# Altium project PVP.PrjPcb
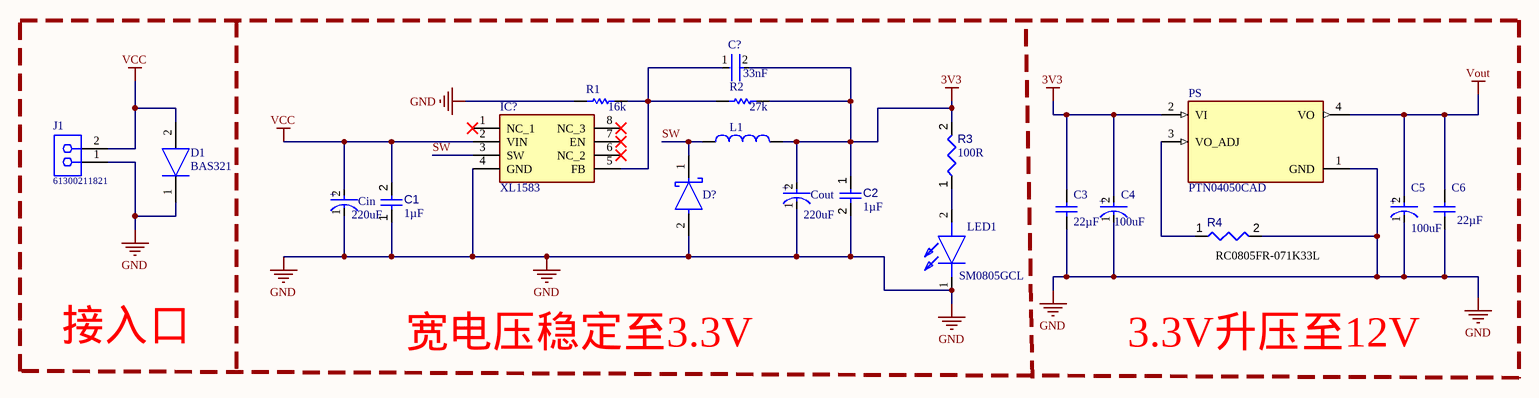
[diagram p0: PVP.SchDoc]
1 sheet, 20 parts. Net scope: global (net labels, ports and power ports of the same name join across sheets).
Board file: PVP.PcbDoc

## Sheet PVP.SchDoc
size A4; SheetNumber: 1; SheetTotal: 1

### Parts
C1  value 1µF  [CAPC2013X135X45NL10T25]  (hidden comment: Capacitor 1 uF +/- 10% 50 V 0805)
C2  value 1µF  [CAPC2013X135X45NL10T25]  (hidden comment: Capacitor 1 uF +/- 10% 50 V 0805)
C3  Capacitance: 22µF  [MURA-1210_H_2.7_L]  (hidden comment: GRM32ER61C226KE20L)
C4  Capacitance: 100uF  [FP-UWX1E101MCL1GB-MFG]  (hidden comment: UWX1E101MCL1GB)
C5  Capacitance: 100uF  [FP-UWX1E101MCL1GB-MFG]  (hidden comment: UWX1E101MCL1GB)
C6  Capacitance: 22µF  [MURA-1210_H_2.7_L]  (hidden comment: GRM32ER61C226KE20L)
C?  Capacitance: 33nF  [FP-C1608-080-0_1-IPC_A]  (hidden comment: C1608X7R1H333K080AA)
Cin  value 220uF  [FP-ESTG4-MFG]  (hidden comment: EST227M035AG4AA)
Cout  value 220uF  [FP-ESTG4-MFG]  (hidden comment: EST227M035AG4AA)
D1  BAS321  [SOD2512X110N]
D?  SS34  [FP-95402-MFG]  (value not drawn)
IC?  XL1583  [SOIC127P600X175-8N]
J1  61300211821  [61300211821]
L1  744212470  [WE-SL1]  (value not drawn)
LED1  SM0805GCL  [LEDC2012X80N]
PS  PTN04050CAD  [CONV_PTN04050CAD]
R1  value 16k  [RESC2013X60X35NL10T20]  (hidden comment: RT0805BRD073KL)
R2  value 27k  [RESC2013X60X35NL10T20]  (hidden comment: RT0805BRD073KL)
R3  value 100R  [RESC2013X60X35ML10T20]  (hidden comment: RC0805FR-07100RL)
R4  1KR5J  [RESC0805(2012)_L]  (value not drawn)

### Nets
3V3: C2.1 C3.2 C4.2(A) C?.2 Cout.2(A) L1.2 PS.2(VI) R2.2 R3.2
GND: C1.1 C2.2 C3.1 C4.1(C) C5.1(C) C6.1 Cin.1(C) Cout.1(C) D1.1(K) D?.2(A) IC?.4(GND) J1.1 LED1.1(K) PS.1(GND) R1.1 R4.2
VCC: C1.2 Cin.2(A) D1.2(A) IC?.2(VIN) J1.2
Vout: C5.2(A) C6.2 PS.4(VO)
SW: D?.1(C) IC?.3(SW) L1.1
NetC?_1: C?.1 IC?.5(FB) R1.2 R2.1
NetLED1_2: LED1.2(A) R3.1
NetPS_3: PS.3(VO_ADJ) R4.1

Not connected (* = marked no-connect by the designer): IC? 1(NC_1)* 6(NC_2)* 7(EN)* 8(NC_3)*

### Notes on the sheet
- (near J1) 外接四块电池板  9V  2W，两块并联，两块串联
- (near D1) 在正常供电的时候二极管反偏;只有当电源反接的时候，二极管正偏导通，此时二极管将后级电路短路。2为正极，1为负极。IFRM=625mA；VRRM=250V；VR=200V。
- 最高12W，最大输出电流3A，输入电压范围为3.6到23V
- (near R4) RC0805FR-071K33L
- 接入口
- 宽电压稳定至3.3V
- (near LED1) 取正向电压2.2V时，对应电流18mA，光强100%左右，则电阻电压为1.1V，1.1v/18ma=61ohm，取100ohm
- 3.3V升压至12V
- 当输出为12V时，电阻要求1.33k，tolerance 1%，100 ppm/°C，以提高精度
- (in symbol CMP-03015-000001-1) +
- (in symbol CMP-12462-000012-1) +

### Library data of the parts
C1 C2 = CMP-001-00007-5: Chip Capacitor, 1 uF, +/- 10%, 50 V, 0805 (2012 Metric); Voltage Rating: 50V; Capacitor Type: Ceramic; Tolerance: 10%; Max Operating Temperature: 125°C; Case/Package: 0805; RoHS Compliant: True; Pins: 2; Mounting Technology: SM; Min Operating Temperature: -55°C
C3 C6 = CMP-2000-06361-1: Chip Monolithic Ceramic Capacitor, 22 uF, +/- 10%, -55 to 85 degC, 2-Pin SMD (1210), RoHS, Tape and Reel; Manufacturer: Murata; Product Training Modules: High-CapMultilayerCeramicCapacitors; Other Names: 490-1882-2; Online Catalog: GRMSeries; Voltage Rating DC: 16V; Temperature Coefficient: X5R; Catalog Drawings: GRMSeries_1210_2.5; Featured Product: GA3SafetyRecognizedCapsandHi-CapMLCC; Applications: GeneralPurpose; Lead Spacing: -; Ratings: -; Standard Package: 1,000; Lead Style: -; Size / Dimension: 0.126"Lx0.098"W(3.20mmx2.50mm); Features: -; Thickness (Max): 0.106"(2.70mm); Package Description: 2-Pin Surface Mount Device, Body 3.2 x 2.5 mm; Series: GRM; Mounting Type: SurfaceMount,MLCC; Category: Capacitors; Package / Case: 1210(3225Metric); Datasheet Version: 05/2014; Datasheet URL: https://datasheet.ciiva.com/26915/getdatasheetpartid-88858-26915376.pdf; Mounting Technology: SurfaceMount; Package Reference: 1210; Tolerance: ±10%; Packaging: Tape&Reel(TR); Operating Temperature: -55°C~85°C; Voltage - Rated: 16V; Height - Seated (Max): -; Family: CeramicCapacitors; Manufacturer URL: http://www.murata.com/
C4 C5 = CMP-12462-000012-1: CAP ALUM 100UF 20% 25V SMD; Lead Diameter: 0.8mm; Polarity: Polar; Life (Hours): 2000Hour; Ripple Current (AC): 110mA; Leakage Current: 3uA; Dissipation Factor: 0.14%; Dielectric Material: Aluminium; Termination: SMD/SMT; Case/Package: Radial; Package Quantity: 1000; Weight: 0.01lb; Lead Free: Lead Free; Diameter: 8mm; Voltage Rating: 25V; Voltage: 25V; Mount: Surface Mount; Lead Pitch: 2.3mm; Width: 0.25inch; Min Operating Temperature: -40°C; REACH SVHC: No SVHC; Max Operating Temperature: 85°C; Height - Seated (Max): 0.213inch; Tolerance: 20%; Voltage Rating (DC): 25V; Number of Pins: 2; Radiation Hardening: No; Packaging: Tape and Reel; Ripple Current: 110mA; Height: 5.4mm; Length: 5.4mm
C? = CMP-08246-003413-1: Multilayer Ceramic Capacitors 33nF ±10% 50V X7R SMD 0603; REACH SVHC: No SVHC; Thickness: 0.037inch; Resistor Type: Ceramic; Weight: 7.1E-05oz; Mount: Surface Mount; Number of Pins: 2; Max Operating Temperature: 125°C; Height: 0.8mm; Length: 1.6mm; Radiation Hardening: No; RoHS Compliant: Yes; Dielectric Material: Ceramic; Width: 0.031inch; Min Operating Temperature: -55°C; Lead Free: Lead Free; Construction: Flat; Dielectric: X7R; Packaging: Tape and Reel; Voltage Rating (DC): 50V; Tolerance: 10%; Voltage Rating: 50V; Case/Package: 0603; Package Quantity: 1; Series: C; Case Code (Imperial): 0603; Depth: 0.8mm; Termination: SMD/SMT; Case Code (Metric): 1608
Cin Cout = CMP-03015-000001-1: CAP ALUM 220UF 20% 35V RADIAL; Manufacturer: Kemet; Leakage Current: 77uA; Life: 7000Hours; Ripple Current: 840mA; Dissipation Factor: 12%; Esr: 0.16Ω; Category: Cap; Octopart: https://octopart.com/est227m035ag4aa-kemet-22264647; Device Class L3: Aluminum Electrolytic Capacitors; Mouser Description: Aluminum Electrolytic Capacitors - Leaded 35volts 220uF 20%; Digikey Description: CAP ALUM 220UF 20% 35V RADIAL; Lead Free: Yes; Device Class L2: Capacitors; Device Class L1: Passive Components; ComponentLink2URL: https://content.kemet.com/datasheets/KEM_A4010_EST.pdf; Manufacturer Part Number: EST227M035AG4AA; Voltage Rating: 35V; Temperature: -40°C to +105°C; Capacitance: 220uF; RoHS: TRUE; Temperature Range High: +105°C; Package: ESTG4; Temperature Range Low: -40°C; Height: 17mm; Material: Aluminum; ComponentLink2Description: Datasheet; Automotive: No; Tolerance: 20%
D1 = BAS321,115: Diode; Manufacturer_Name: Nexperia; Datasheet Link: http://assets.nexperia.com/documents/data-sheet/BAS321.pdf; Height: 1.1mm; Manufacturer_Part_Number: BAS321,115; Mouser Part Number: 771-BAS321-T/R; Mouser Price/Stock: https://www.mouser.co.uk/ProductDetail/Nexperia/BAS321115?qs=me8TqzrmIYWNWEvaRIZtSg%3D%3D; Arrow Part Number: BAS321,115; Arrow Price/Stock: https://www.arrow.com/en/products/bas321115/nexperia
D? = CMP-02539-000012-1: DIODE SCHOTTKY 40V 3A DO214AB; Manufacturer: Vishay; Manufacturer Part Number: SS34-E3/57T; Max Junction Temp: +150°C; Peak Reverse Current: 0.5mA; Max Surge Forward Current: 100A; Standoff Height: 0mm; ComponentLink2Description: Datasheet; Device Class L3: Schottky Diodes; Height: 2.62mm; Max Repetitive Reverse Voltage: 40V; Lead Free: Yes; Package: 95402; Temperature Range High: +150°C; ComponentLink2URL: http://www.vishay.com/docs/88751/ss32.pdf; Temperature: -55°C to +150°C; Footprint Url: http://www.vishay.com/docs/95402/smc.pdf; Automotive: No; Forward Current: 3A; Category: Diode; RoHS: TRUE; Device Class L2: Diodes; Mouser Description: Schottky Diodes & Rectifiers 3.0 Amp 40 Volt; Octopart: https://octopart.com/ss34-e3%2F57t-vishay-39552907; Temperature Range Low: -55°C; Device Class L1: Discrete Semiconductors; Digikey Description: DIODE SCHOTTKY 40V 3A DO214AB
IC? = XL1583: Integrated Circuit; Manufacturer_Name: XLSEMI; Datasheet Link: https://pdf1.alldatasheet.com/datasheet-pdf/view/763160/ETC2/XL1583E1.html; Height: 1.75mm; Manufacturer_Part_Number: XL1583
J1 = 61300211821: WR-PHD Socket Header, THT, pitch 2.54mm, Single Row, Vertical, 2p; Manufacturer: Wurth Elektronik; Pin Number: 2; Rated Current: 3A; Working Voltage: 250VAC; Withstanding Voltage: 500VAC; Contact Resistance: 20mOhm; ComponentLink1Description: Manufacturer; ComponentLink1URL: http://www.we-online.de; ComponentLink2Description: Datasheet; ComponentLink2URL: https://www.we-online.com/catalog/datasheet/61300211821.pdf; Manufacturer Part Number: 61300211821; Published Date: May 2020; Pitch: 2.54mm; Operating Temperature: -40 to +125degC; Mounting Technology: THT; Packaging: Tray; Gender: Socket Header; Row Number: Single; Orientation: Vertical
L1 = CMP-006-00021-1: WE-SL1; Wire-wound SMD Induc. with Ferrite Core, 47 µH; Sectional Winding 300mA; Tolerance: 50%; Self Resonant Frequency: 100kHz; Max Current Rating: 4A; Case/Package: SMD/SMT; Min Operating Temperature: -40°C; Max Operating Temperature: 105°C; RoHS Compliant: Yes; Current Rating: 300mA
LED1 = SM0805GCL: LED; Manufacturer_Name: Bivar; Datasheet Link: http://www.bivar.com/portals/0/products/SM0805GCL.pdf; Height: 0.8mm; Manufacturer_Part_Number: SM0805GCL; Mouser Part Number: 749-SM0805GCL; Mouser Price/Stock: https://www.mouser.co.uk/ProductDetail/Bivar/SM0805GCL?qs=jaLxTFIJCitl%252Bw30syUp6A%3D%3D; Arrow Part Number: SM0805GCL; Arrow Price/Stock: https://www.arrow.com/en/products/sm0805gcl/bivar
PS = PTN04050CAD: 12-W, 3.3/5-V Input, Wide Adjust Output Boost Converter; Package: None; Value: *; MP: PTN04050CAD; Availability: Unavailable; Price: None
R1 R2 = CMP-2001-01742-1: Manufacturer: Yageo; Part Number: RT0805BRD073KL
R3 = CMP-009-00180-1: Res Thick Film 0805 100 Ohm 1% 1/8W ±100ppm/°C Molded SMD Paper T/R; Voltage Rating: 150V; Max Operating Temperature: 155°C; Min Operating Temperature: -55°C; Tolerance: 1%; Case/Package: 0805; RoHS Compliant: Yes
R4 = CMP-009-00076-1: 1K 0.125W 5% 0805 (2012 Metric)  SMD; Value: 1kΩ; Mounting Technology: SMT; Power: 0.125W; Pins: 2; Case/Package: 0805; Tolerance: 5%